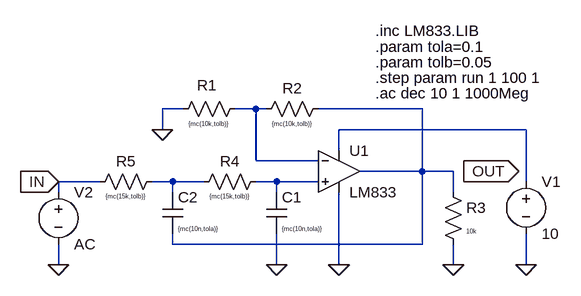
[diagram p0: schematic Test.asc]
Test.asc, the LTspice schematic file:
Version 4
SHEET 1 880 680
WIRE -80 64 -112 64
WIRE 32 64 0 64
WIRE 48 64 32 64
WIRE 288 64 128 64
WIRE -112 96 -112 64
WIRE 448 96 160 96
WIRE 160 128 160 96
WIRE 32 144 32 64
WIRE 128 144 32 144
WIRE 288 160 288 64
WIRE 288 160 192 160
WIRE 336 160 288 160
WIRE -208 176 -272 176
WIRE -96 176 -128 176
WIRE -48 176 -96 176
WIRE 64 176 32 176
WIRE 128 176 64 176
WIRE 448 176 448 96
WIRE -272 192 -272 176
WIRE -96 192 -96 176
WIRE 64 192 64 176
WIRE 336 192 336 160
WIRE -96 272 -96 256
WIRE 288 272 288 160
WIRE 288 272 -96 272
WIRE -272 304 -272 272
WIRE 64 304 64 256
WIRE 160 304 160 192
WIRE 336 304 336 272
WIRE 448 304 448 256
FLAG 448 304 0
FLAG 160 304 0
FLAG -112 96 0
FLAG 352 160 OUT
IOPIN 352 160 Out
FLAG 336 304 0
FLAG 64 304 0
FLAG -272 304 0
FLAG -272 176 IN
IOPIN -272 176 In
SYMBOL OpAmps\\opamp2 160 96 R0
SYMATTR InstName U1
SYMATTR Value LM833
SYMBOL voltage 448 160 R0
SYMATTR InstName V1
SYMATTR Value 10
SYMBOL voltage -272 176 R0
SYMATTR InstName V2
SYMATTR Value AC
SYMBOL res 16 48 R90
WINDOW 0 -5 59 VBottom 2
WINDOW 3 32 56 VTop 0
SYMATTR InstName R1
SYMATTR Value {mc(10k,tolb)}
SYMBOL res 144 48 R90
WINDOW 0 0 56 VBottom 2
WINDOW 3 32 56 VTop 0
SYMATTR InstName R2
SYMATTR Value {mc(10k,tolb)}
SYMBOL res 320 176 R0
WINDOW 3 36 76 Left 0
SYMATTR Value 10k
SYMATTR InstName R3
SYMBOL cap 48 192 R0
WINDOW 3 24 56 Left 0
SYMATTR Value {mc(10n,tola)}
SYMATTR InstName C1
SYMBOL res 48 160 R90
WINDOW 0 0 56 VBottom 2
WINDOW 3 32 56 VTop 0
SYMATTR InstName R4
SYMATTR Value {mc(15k,tolb)}
SYMBOL cap -112 192 R0
WINDOW 3 24 56 Left 0
SYMATTR Value {mc(10n,tola)}
SYMATTR InstName C2
SYMBOL res -112 160 R90
WINDOW 0 0 56 VBottom 2
WINDOW 3 32 56 VTop 0
SYMATTR InstName R5
SYMATTR Value {mc(15k,tolb)}
TEXT 216 -56 Left 2 !.inc LM833.LIB
TEXT 216 -32 Left 2 !.param tola=0.1
TEXT 216 -8 Left 2 !.param tolb=0.05
TEXT 216 16 Left 2 !.step param run 1 100 1
TEXT 216 40 Left 2 !.ac dec 10 1 1000Meg

The netlist it stands for:
* Test.asc
XU1 N005 N001 N003 0 N002 LM833  ; pins In+ In- V+ V- OUT
V1 N003 0 10
V2 IN 0 AC
R1 N001 0 {mc(10k,tolb)}
R2 N002 N001 {mc(10k,tolb)}
R3 N002 0 10k
C1 N005 0 {mc(10n,tola)}
R4 N005 N004 {mc(15k,tolb)}
C2 N004 N002 {mc(10n,tola)}
R5 N004 IN {mc(15k,tolb)}
.inc LM833.LIB
.param tola=0.1
.param tolb=0.05
.step param run 1 100 1
.ac dec 10 1 1000Meg
.backanno
.end